# Altium schematic sheet power.SchDoc
size A4; SheetNumber: 1; SheetTotal: 1
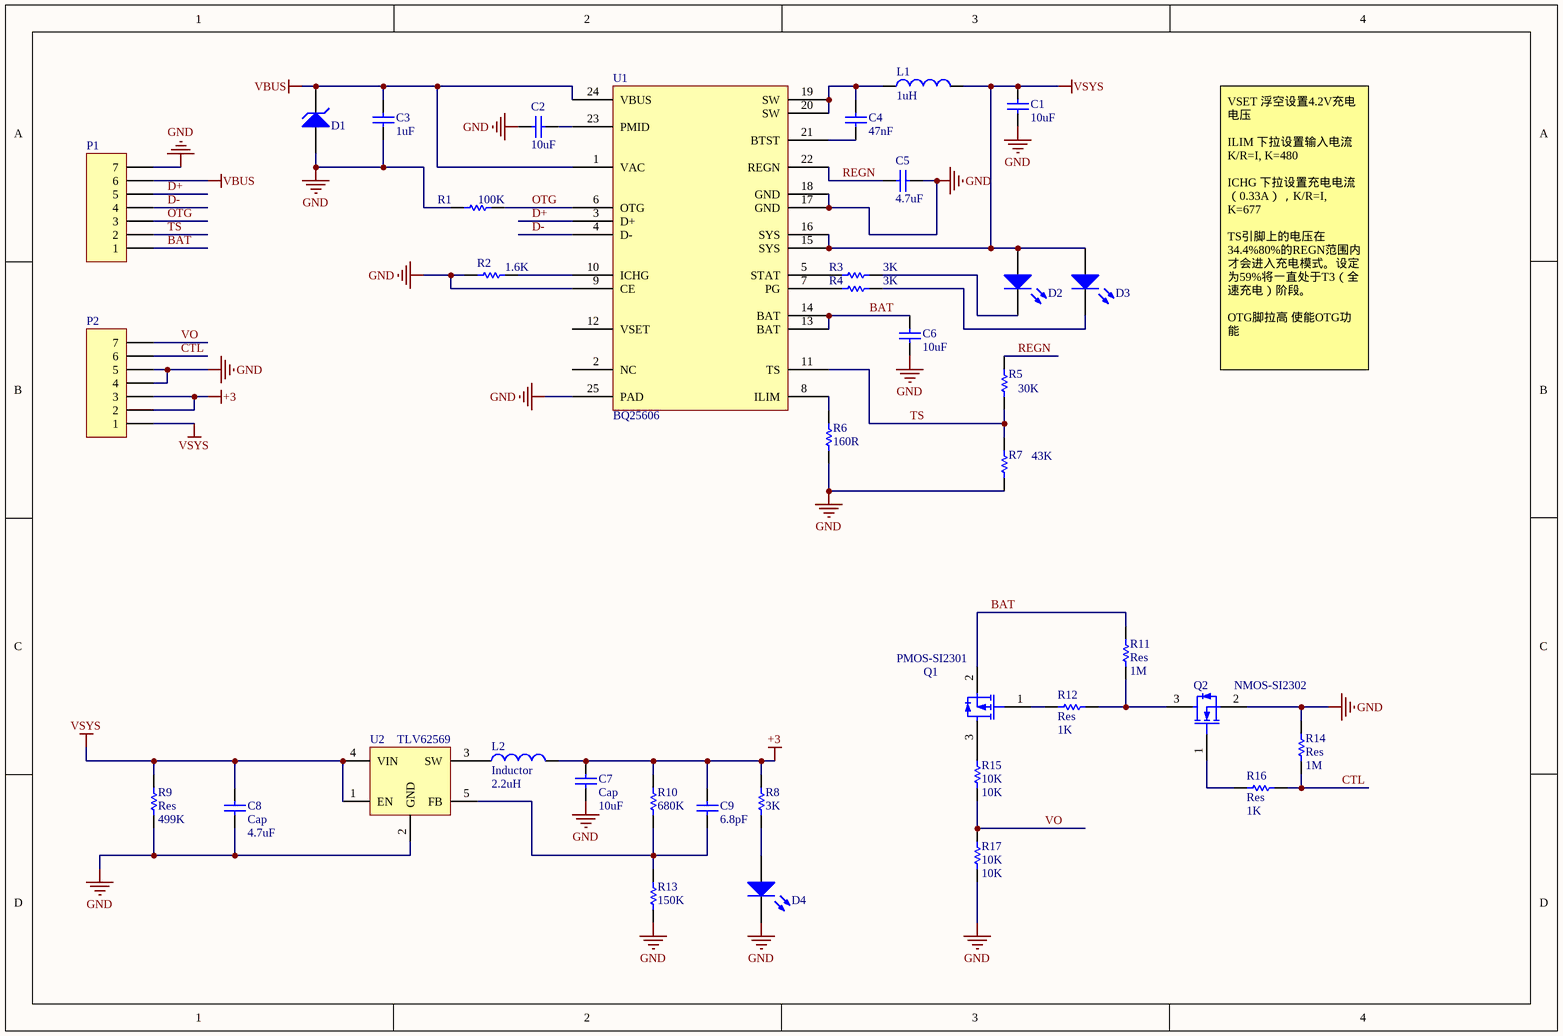
[diagram p0: power.SchDoc]

## Parts
C1  10uF  [6-0805_L]
C2  10uF  [6-0805_L]
C3  1uF  [6-0805_L]
C4  47nF  [0402]
C5  4.7uF  [6-0805_L]
C6  10uF  [6-0805_L]
C7  Cap  value 10uF  [6-0805_L]
C8  Cap  value 4.7uF  [6-0805_L]
C9  6.8pF  [0402]
D1  D  [PESD-SOD323]  (value not drawn)
D2  LED RED  [0402-p]  (value not drawn)
D3  LED  [0402-p]  (value not drawn)
D4  LED  [0402-p]  (value not drawn)
L1  1uH  [L2520-INDP2520X20L]
L2  Inductor  value 2.2uH  [L2520-INDP2520X20L]
P1  Header 7  [DIP7-HOLE]  (value not drawn)
P2  Header 7  [DIP7-HOLE]  (value not drawn)
Q1  PMOS-SI2301  [SOT23-3]
Q2  NMOS-SI2302  [SOT23-3]
R1  100K  [0402]
R2  1.6K  [0402]
R3  3K  [0402]
R4  3K  [0402]
R5  30K  [0402]
R6  160R  [0402]
R7  43K  [0402]
R8  3K  [0402]
R9  Res  value 499K  [0402]
R10  680K  [0402]
R11  Res  value 1M  [0402]
R12  Res  value 1K  [0402]
R13  150K  [0402]
R14  Res  value 1M  [0402]
R15  10K  [0402]
R16  Res  value 1K  [0402]
R17  10K  [0402]
U1  BQ25606  [QFN24-BQ25606]
U2  TLV62569  [SOT23-5]

## Nets
+3: C7.2 C9.2 L2.2 P2.2 P2.3 R8.2 R10.2
GND: C1.2 C2.2 C3.1 C5.2 C6.2 C7.1 C8.1 D1.2(A) D4.1(K) P1.7 P2.4 P2.5 Q2.2(S) R1.2 R2.2 R6.1 R7.2 R9.1 R13.1 R14.1 R17.1 U1.9(CE) U1.17(GND) U1.18(GND) U1.25(PAD) U2.2(GND)
VBUS: C3.2 D1.1(K) P1.6 U1.1(VAC) U1.24(VBUS)
VSYS: C1.1 C8.2 D2.2(A) D3.2(A) L1.2 P2.1 R9.2 U1.15(SYS) U1.16(SYS) U2.1(EN) U2.4(VIN)
BAT: C6.1 P1.1 Q1.2(S) R11.2 U1.13(BAT) U1.14(BAT)
CTL: P2.6 R14.2 R16.2
D+: P1.5 U1.3(D+)
D-: P1.4 U1.4(D-)
OTG: P1.3 R1.1 U1.6(OTG)
REGN: C5.1 R5.1 U1.22(REGN)
TS: P1.2 R5.2 R7.1 U1.11(TS)
VO: P2.7 R15.1 R17.2
NetC2_1: C2.1 U1.23(PMID)
NetC4_1: C4.1 U1.21(BTST)
NetC4_2: C4.2 L1.1 U1.19(SW) U1.20(SW)
NetC9_1: C9.1 R10.1 R13.2 U2.5(FB)
NetD2_1: D2.1(K) R3.1
NetD3_1: D3.1(K) R4.1
NetD4_2: D4.2(A) R8.1
NetL2_1: L2.1 U2.3(SW)
NetQ1_1: Q1.1(G) R12.2
NetQ1_3: Q1.3(D) R15.2
NetQ2_1: Q2.1(G) R16.1
NetQ2_3: Q2.3(D) R11.1 R12.1
NetR2_1: R2.1 U1.10(ICHG)
NetR3_2: R3.2 U1.5(STAT)
NetR4_2: R4.2 U1.7(PG)
NetR6_2: R6.2 U1.8(ILIM)

Not connected (* = marked no-connect by the designer): U1 2(NC) 12(VSET)

## Notes on the sheet
- VSET 浮空设置4.2V充电电压
  ILIM 下拉设置输入电流
  K/R=I, K=480
  ICHG 下拉设置充电电流（0.33A），K/R=I, K=677
  TS引脚上的电压在34.4%80%的REGN范围内才会进入充电模式。设定为59%将一直处于T3（全速充电）阶段。
  OTG脚拉高 使能OTG功能

## Library data of the parts
C1-C9 = Cap: Capacitor; Published: 8-Jun-2000; LatestRevisionDate: 17-Jul-2002; LatestRevisionNote: Re-released for DXP Platform.; PackageReference: RAD-0.3; Publisher: Altium Limited; PackageDescription: Radial Cap, Thru-Hole; 2 Leads; 0.3 in Pin Spacing
  C1 C2 C6: Value: 10uF
  C3: Value: 1uF
  C4: Value: 47nF
  C5: Value: 4.7uF
  C9: Value: 6.8pF
D2 = LED
L1 L2 = Inductor: Code_IEC: 1005; Published: 8-Jun-2000; LatestRevisionDate: 29-May-2009; LatestRevisionNote: IPC-7351 Footprint Added.; PackageReference: 0402-A; Publisher: Altium Limited; PackageDescription: Chip Inductor; Code_JEITA: 0402
  L1: Value: 1uH
P1 P2 = Header 7: Header, 7-Pin; LatestRevisionDate: 17-Jul-2002; LatestRevisionNote: Re-released for DXP Platform.; Publisher: Altium Limited
Q1 = PMOS
Q2 = NMOS
R1-R5 R7-R17 = Res1: Resistor; Published: 8-Jun-2000; LatestRevisionDate: 17-Jul-2002; LatestRevisionNote: Re-released for DXP Platform.; PackageReference: AXIAL-0.3; Publisher: Altium Limited; PackageDescription: Axial Device, Thru-Hole; 2 Leads; 0.3 in Pin Spacing
  R1: Value: 100K
  R2: Value: 1.6K
  R3 R4 R8: Value: 3K
  R5: Value: 30K
  R7: Value: 43K
  R10: Value: 680K
  R13: Value: 150K
  R15 R17: Value: 10K
R6 = Res1: Resistor; Value: 160; Published: 8-Jun-2000; LatestRevisionDate: 17-Jul-2002; LatestRevisionNote: Re-released for DXP Platform.; PackageReference: AXIAL-0.3; Publisher: Altium Limited; PackageDescription: Axial Device, Thru-Hole; 2 Leads; 0.3 in Pin Spacing